# Altium project NANORACK_LASER.PrjPcb
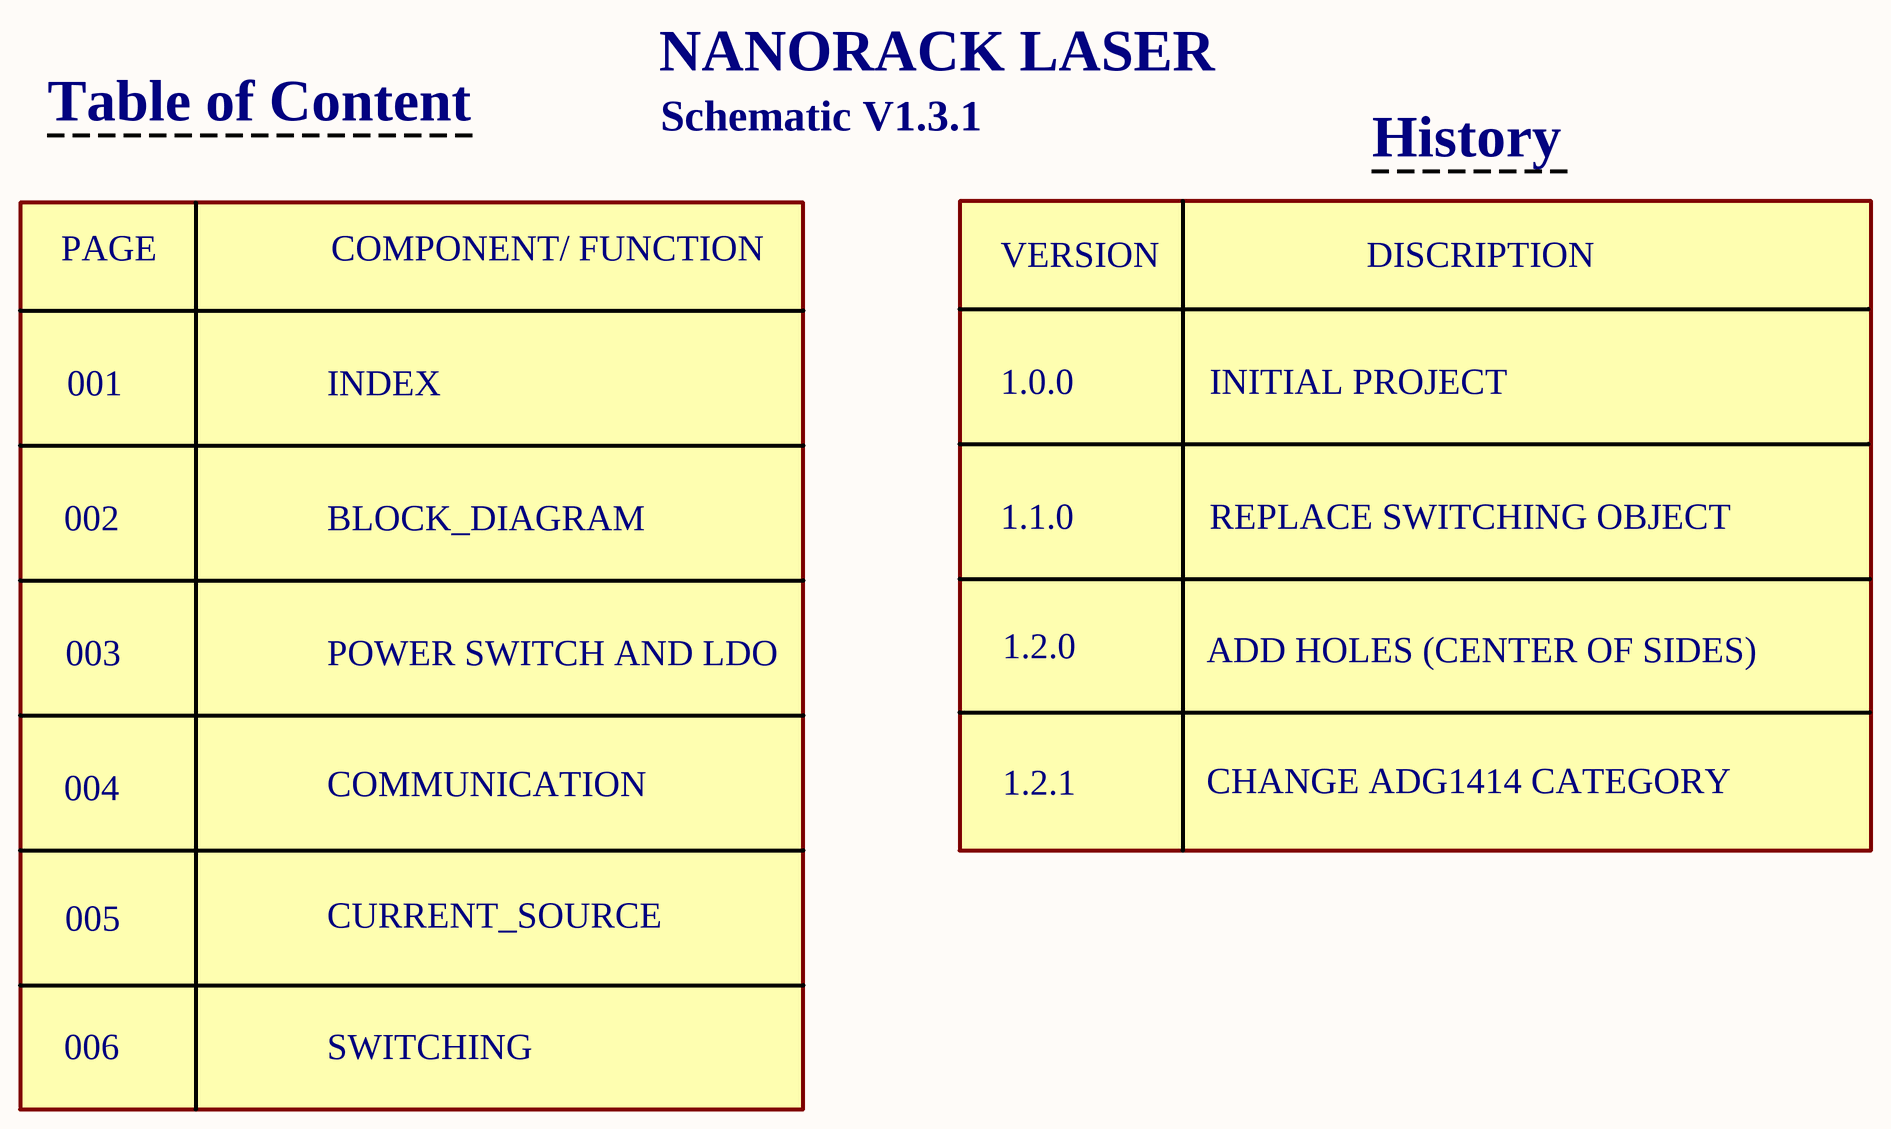
[diagram p0: INDEX.SchDoc]
4 sheets, 57 parts. Net scope: global (net labels, ports and power ports of the same name join across sheets).
Board file: LASERDIODE_V1.2.1.PcbDoc
Sheets:
  INDEX.SchDoc
  BLOCK_DIAGRAM.SchDoc
  POWER SWITCH AND LDO.SchDoc
  COMMUNICATION.SchDoc

## Sheet INDEX.SchDoc
size 420 x 297 mm; SheetNumber: 1; SheetTotal: 6

### Notes on the sheet
- NANORACK LASER
- Table of Content
- Schematic V1.3.1
- History
- PAGE
- COMPONENT/ FUNCTION
- VERSION
- DISCRIPTION
- 001
- INDEX
- 1.0.0
- INITIAL PROJECT
- 002
- BLOCK_DIAGRAM
- 1.1.0
- REPLACE SWITCHING OBJECT
- 003
- POWER SWITCH AND LDO
- 1.2.0
- ADD HOLES (CENTER OF SIDES)
- 004
- COMMUNICATION
- 1.2.1
- CHANGE ADG1414 CATEGORY
- 005
- CURRENT_SOURCE
- 006
- SWITCHING
- Project:
- BEE-PC1
- Sub-system:
- Design by:
- Hung Nguyen D.
- Bao Bui Q.
- Sheet title:
- Sheet
- A3
- of
- Checked by:
- Approved by:
- Vu Pham
- Revision:
- Document No:
- V1.2.1
- Size:
- Date:

## Sheet BLOCK_DIAGRAM.SchDoc
size 420 x 297 mm; SheetNumber: 2; SheetTotal: 6

### Notes on the sheet
- Project:
- BEE-PC1
- Sub-system:
- Design by:
- Hung Nguyen D.
- Bao Bui Q.
- Sheet title:
- Sheet
- A3
- of
- Checked by:
- Approved by:
- Vu Pham
- Revision:
- Document No:
- V1.2.1
- Size:
- Date:
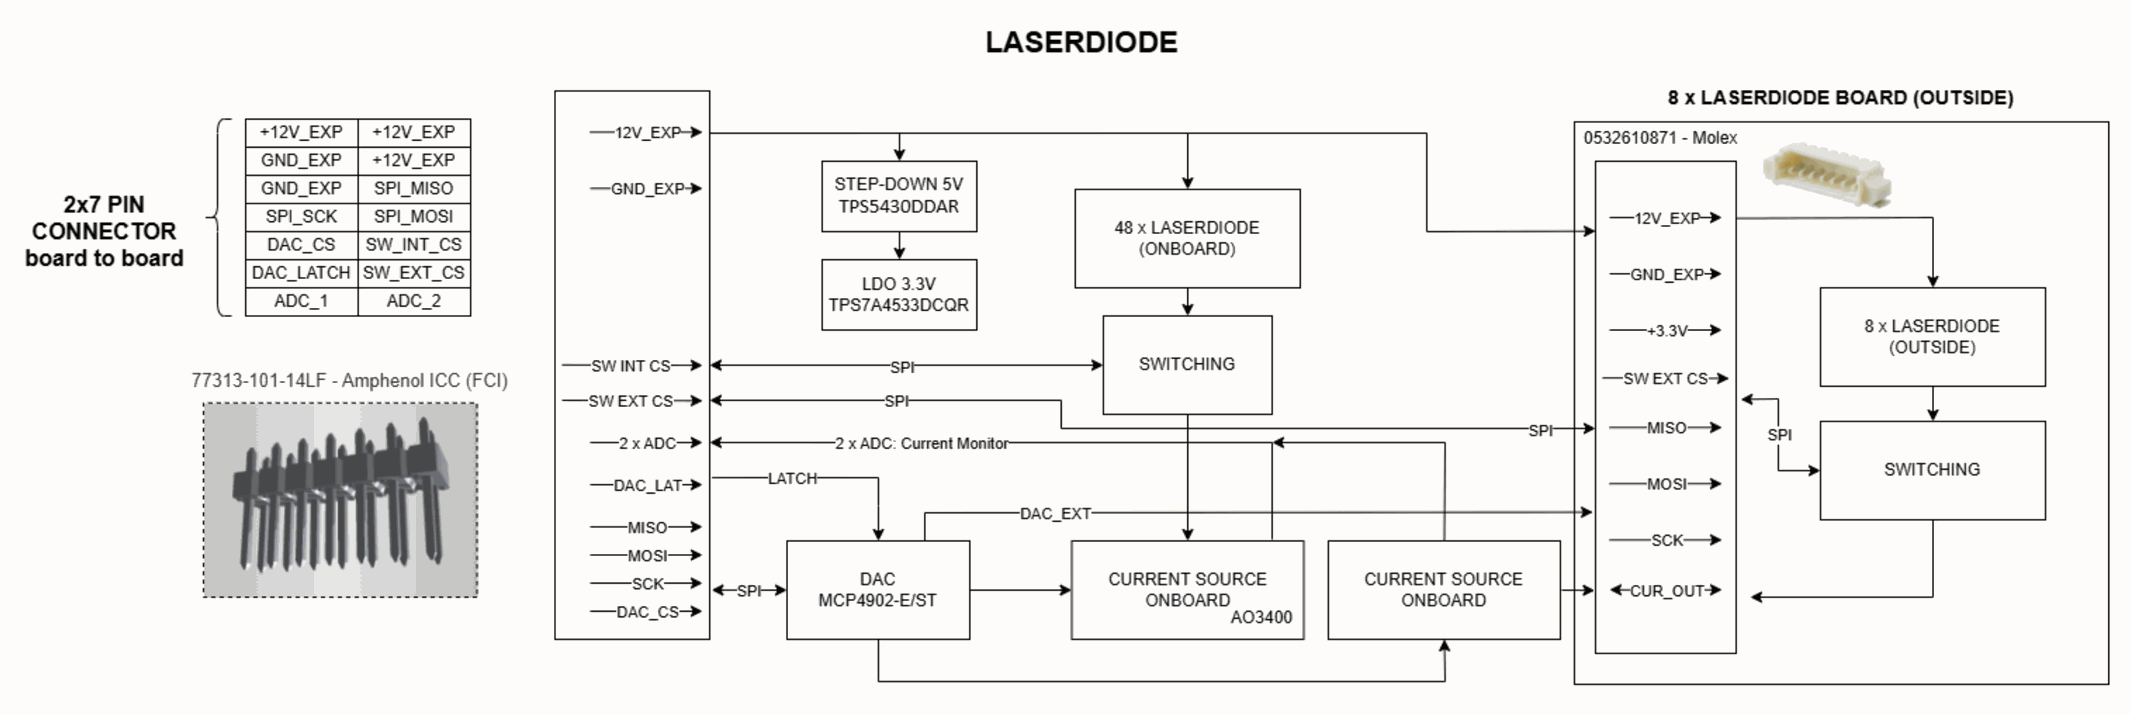
[diagram p1: BLOCK_DIAGRAM.SchDoc]

## Sheet POWER SWITCH AND LDO.SchDoc
size 420 x 297 mm; SheetNumber: 3; SheetTotal: 6
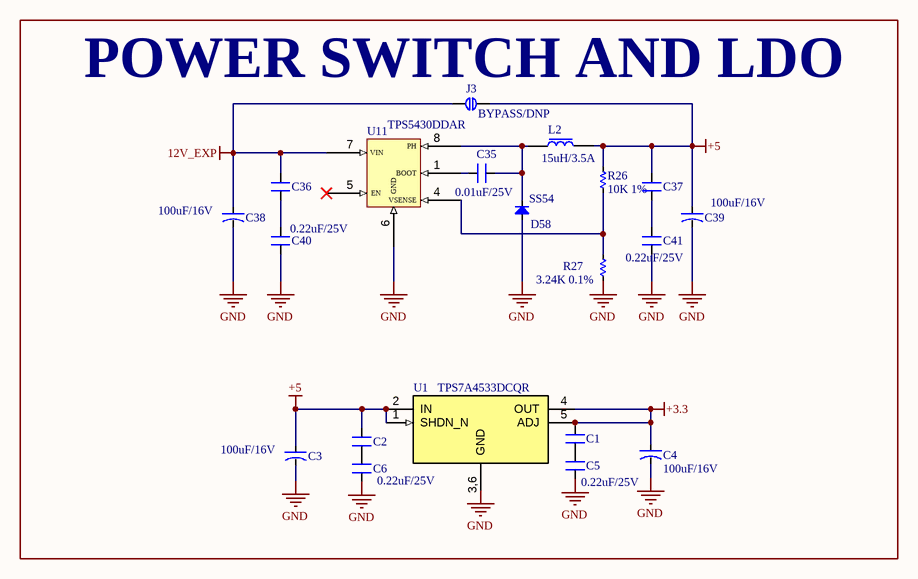
[diagram p2: POWER SWITCH AND LDO.SchDoc]

### Parts
C1  0.22uF/25V  [SM-0603]  (value not drawn)
C2  0.22uF/25V  [SM-0603]
C3  100uF/16V  [CAP TANT 2312]
C4  100uF/16V  [CAP TANT 2312]
C5  0.22uF/25V  [SM-0603]
C6  0.22uF/25V  [SM-0603]  (value not drawn)
C35  0.01uF/25V  [SM-0603]
C36  0.22uF/25V  [SM-0603]  (value not drawn)
C37  0.22uF/25V  [SM-0603]  (value not drawn)
C38  100uF/16V  [CAP TANT 2312]
C39  100uF/16V  [CAP TANT 2312]
C40  0.22uF/25V  [SM-0603]
C41  0.22uF/25V  [SM-0603]
D58  SS54  [DIO-SMD-A]
J3  BYPASS/DNP  [BIG_CONNECTOR]
L2  15uH/3.5A  [SRP7050TA]
R26  10K 1%  [RES-SMD-0603]
R27  3.24K 0.1%  [RES-SMD-0603]
U1  TPS7A4533DCQR  [SOT223-6]
U11  TPS5430DDAR  [HSOP8]

### Blocks framed on the sheet
POWER SWITCH AND LDO: C1-C6 C35-C41 D58 J3 L2 R26 R27 U1 U11

### Nets
12V_EXP: C36.2 C38.1 J3.1 U11.7(VIN)
+3.3: C1.2 C4.1 U1.4(OUT) U1.5(ADJ)
+5: C2.2 C3.1 C37.2 C39.1 J3.2 L2.2 R26.2 U1.1(SHDN_N) U1.2(IN)
GND: C3.2 C4.2 C5.1 C6.1 C38.2 C39.2 C40.1 C41.1 D58.1(A) R27.1 U1.3,6(GND) U11.6(GND)
NetC1_1: C1.1 C5.2
NetC2_1: C2.1 C6.2
NetC35_1: C35.1 D58.2(K) L2.1 U11.8(PH)
NetC35_2: C35.2 U11.1(BOOT)
NetC36_1: C36.1 C40.2
NetC37_1: C37.1 C41.2
NetR26_1: R26.1 R27.2 U11.4(VSENSE)

Not connected (* = marked no-connect by the designer): U11 5(EN)*

### Notes on the sheet
- Project:
- BEE-PC1
- Sub-system:
- Design by:
- Hung Nguyen D.
- Bao Bui Q.
- Sheet title:
- Sheet
- A3
- of
- Checked by:
- Approved by:
- Vu Pham
- Revision:
- Document No:
- V1.2.1
- Size:
- Date:

### Library data of the parts
C1 C2 C5 C6 C35-C37 C40 C41 = CM: 0603; Value: 103
C3 C4 C38 C39 = CN-ALU-SMD: Polarized Capacitor (Axial); Published: 8-Jun-2000; LatestRevisionDate: 17-Jul-2002; LatestRevisionNote: Re-released for DXP Platform.; PackageReference: POLAR0.8; Publisher: Altium Limited
D58 = Diode SMD: DIODE SCHOTTKY 40V 5A SMA; Code - JEDEC: DO-214-AB; Value: 1N5007; Published: 8-Jun-2000; Revision: July-2002: Re-released for DXP Platform.; Publisher: Altium Limited
J3 = CNT: DNP
L2 = INDUCTOR: SRP7050TA-150M
R26 = Res-SMD: 0603; Manufacturer: Generic Components; Class: Passive; Published: 08/06/2000; Publisher: Altium Hobart Technology Centre
R27 = Res-SMD: ERA-3AEB3241V; Manufacturer: Generic Components; Class: Passive; Published: 08/06/2000; Publisher: Altium Hobart Technology Centre
U1 = TPS7A4533DCQR: IC REG LINEAR 3.3V 1.5A SOT223-6
U11 = TPS543X: 8SOP; pin to pad: 6>6+9

## Sheet COMMUNICATION.SchDoc
size 420 x 297 mm; SheetNumber: 4; SheetTotal: 6
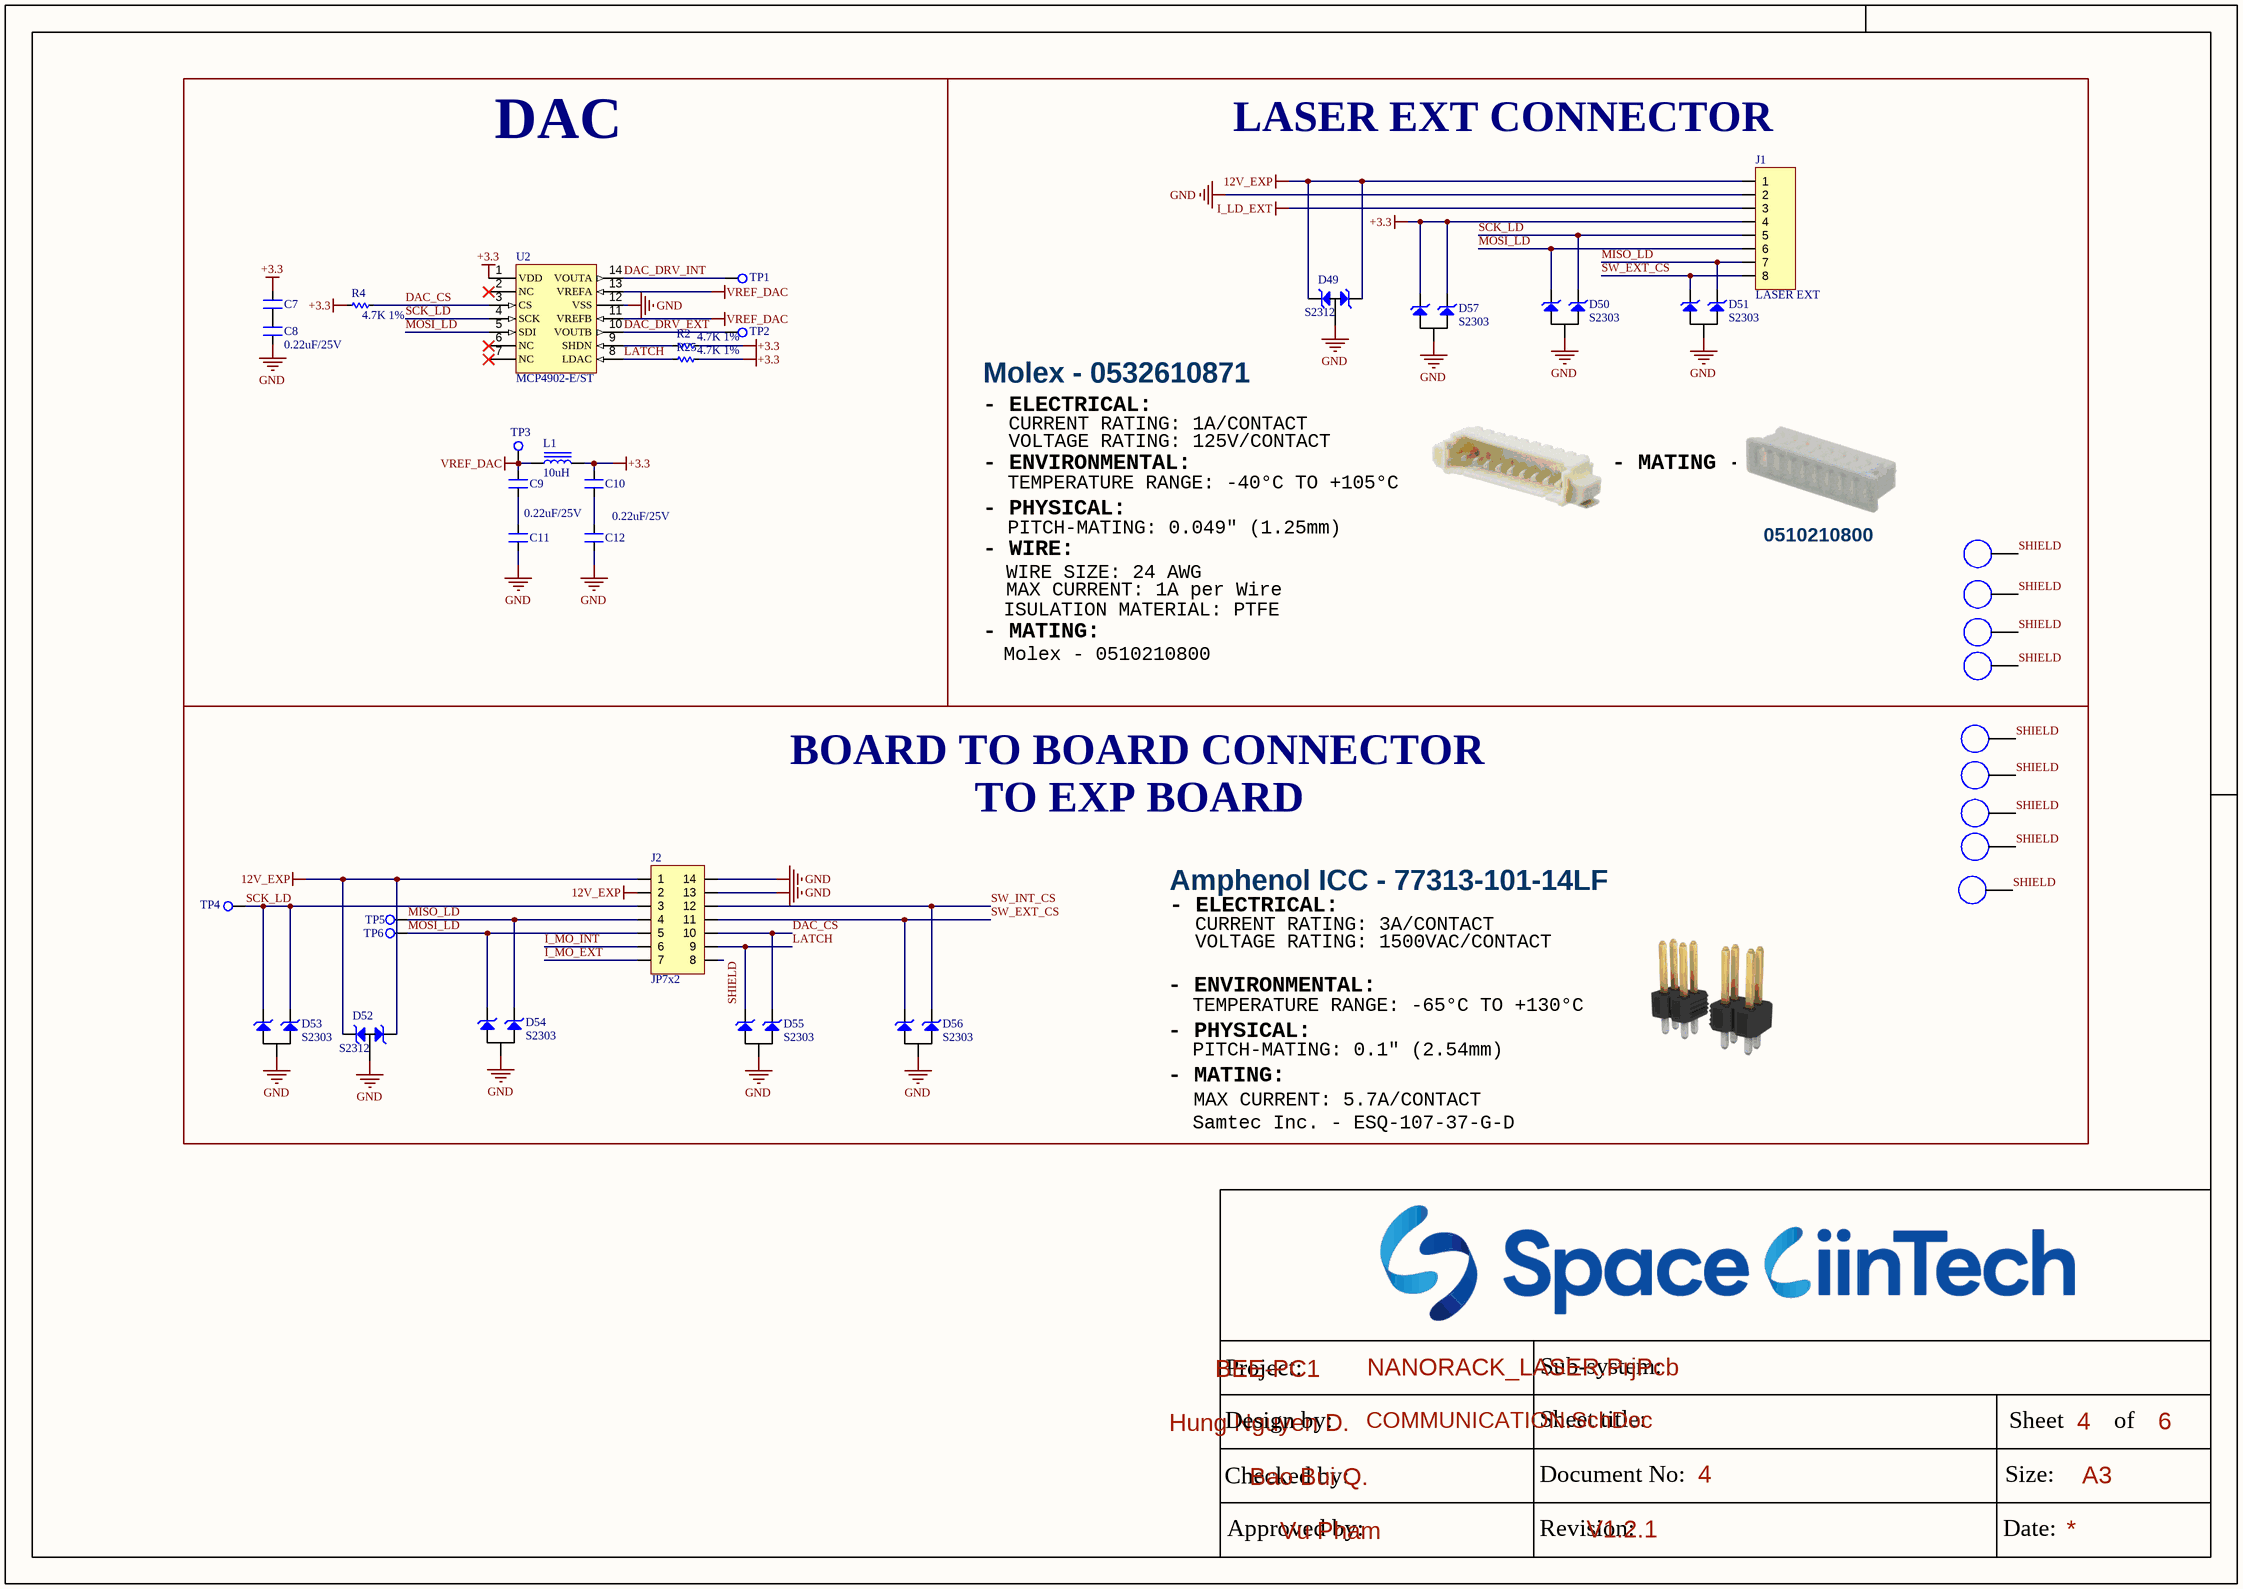
[diagram p3: COMMUNICATION.SchDoc]

### Parts
C7  0.22uF/25V  [SM-0603]  (value not drawn)
C8  0.22uF/25V  [SM-0603]
C9  0.22uF/25V  [SM-0603]  (value not drawn)
C10  0.22uF/25V  [SM-0603]  (value not drawn)
C11  0.22uF/25V  [SM-0603]
C12  0.22uF/25V  [SM-0603]
D49  S2312  [SOT23-123]
D50  S2303  [SOT23-123]
D51  S2303  [SOT23-123]
D52  S2312  [SOT23-123]
D53  S2303  [SOT23-123]
D54  S2303  [SOT23-123]
D55  S2303  [SOT23-123]
D56  S2303  [SOT23-123]
D57  S2303  [SOT23-123]
H1  HOLD  [M3]  (value not drawn)
H2  HOLD  [M3]  (value not drawn)
H3  HOLD  [M3]  (value not drawn)
H4  HOLD  [M3]  (value not drawn)
H5  HOLD  [M3]  (value not drawn)
H6  HOLD  [M3]  (value not drawn)
H7  HOLD  [M3]  (value not drawn)
H8  HOLD  [M3]  (value not drawn)
H9  HOLD  [M3]  (value not drawn)
J1  LASER EXT  [0532610871]
J2  JP7x2  [JP7-D2T]
L1  10uH  [FER 0805/2012]
R2  4.7K 1%  [RES-SMD-0603]
R4  4.7K 1%  [RES-SMD-0603]
R25  4.7K 1%  [RES-SMD-0603]
TP1  Test_Point  [TESTPOINT]  (value not drawn)
TP2  Test_Point  [TESTPOINT]  (value not drawn)
TP3  Test_Point  [TESTPOINT]  (value not drawn)
TP4  Test_Point  [TESTPOINT]  (value not drawn)
TP5  Test_Point  [TESTPOINT]  (value not drawn)
TP6  Test_Point  [TESTPOINT]  (value not drawn)
U2  MCP4902-E/ST  [TSSOP14]

### Blocks framed on the sheet
DAC: C7-C12 L1 R2 R4 R25 TP1-TP3 U2
LASER EXT CONNECTOR: D49-D51 D57 H1-H3 H8 J1

### Nets
12V_EXP: D49.1 D49.3 D52.1 D52.3 J1.1 J2.1 J2.2
+3.3: C7.2 C10.2 D57.1 D57.3 J1.4 L1.2 R2.1 R4.2 R25.1 U2.1(VDD)
GND: C8.1 C11.1 C12.1 D49.2 D50.2 D51.2 D52.2 D53.2 D54.2 D55.2 D56.2 D57.2 J1.2 J2.13 J2.14 U2.12(VSS)
I_LD_EXT: J1.3
VREF_DAC: C9.2 L1.1 TP3.1 U2.11(VREFB) U2.13(VREFA)
DAC_CS: D55.3 J2.10 R4.1 U2.3(CS)
DAC_DRV_EXT: TP2.1 U2.10(VOUTB)
DAC_DRV_INT: TP1.1 U2.14(VOUTA)
I_MO_EXT: J2.7
I_MO_INT: J2.6
LATCH: D55.1 J2.9 R25.2 U2.8(LDAC)
MISO_LD: D51.3 D54.3 J1.7 J2.4 TP5.1
MOSI_LD: D50.1 D54.1 J1.6 J2.5 TP6.1 U2.5(SDI)
SCK_LD: D50.3 D53.1 D53.3 J1.5 J2.3 TP4.1 U2.4(SCK)
SHIELD: H1.1 H2.1 H3.1 H4.1 H5.1 H6.1 H7.1 H8.1 H9.1 J2.8
SW_EXT_CS: D51.1 D56.1 J1.8 J2.11
SW_INT_CS: D56.3 J2.12
NetC7_1: C7.1 C8.2
NetC9_1: C9.1 C11.2
NetC10_1: C10.1 C12.2
NetR2_2: R2.2 U2.9(SHDN)

Not connected (* = marked no-connect by the designer): U2 2(NC)* 6(NC)* 7(NC)*

### Notes on the sheet
- Molex - 0532610871
- - ELECTRICAL:
- CURRENT RATING: 1A/CONTACT
- VOLTAGE RATING: 125V/CONTACT
- - ENVIRONMENTAL:
- - PHYSICAL:
- TEMPERATURE RANGE: -40°C TO +105°C
- - MATING -
- - WIRE:
- WIRE SIZE: 24 AWG
- MAX CURRENT: 1A per Wire
- PITCH-MATING: 0.049" (1.25mm)
- 0510210800
- - MATING:
- ISULATION MATERIAL: PTFE
- Molex - 0510210800
- BOARD TO BOARD CONNECTOR
- TO EXP BOARD
- Amphenol ICC - 77313-101-14LF
- CURRENT RATING: 3A/CONTACT
- VOLTAGE RATING: 1500VAC/CONTACT
- TEMPERATURE RANGE: -65°C TO +130°C
- PITCH-MATING: 0.1" (2.54mm)
- Samtec Inc. - ESQ-107-37-G-D
- MAX CURRENT: 5.7A/CONTACT
- Project:
- BEE-PC1
- Sub-system:
- Design by:
- Hung Nguyen D.
- Bao Bui Q.
- Sheet title:
- Sheet
- A3
- of
- Checked by:
- Approved by:
- Vu Pham
- Revision:
- Document No:
- V1.2.1
- Size:
- Date:

### Library data of the parts
C7-C12 = CM: 0603; Value: 103
D49 D52 = S2315: TVS DIODE 12VWM 19VC SOT23, P/N:  S2312
D50 D51 D53-D57 = S2303: TVS DIODE 3.3VWM 8VC SOT23, P/N: / S2303
H1-H9 = PAD_HOLD
J1 = JP8: WR-PHD 2.54 mm Angled Socket Header; Manufacturer: W¨¹rth Elektronik eiSos GmbH; partNo: 613008143121; ComponentLink1 Description: Manufacturer; ComponentLink2 Description: Datasheet; NoPins: 08; Created Date: 29 March 2013; ComponentLink1URL: http://www.we-online.com; ComponentLink2URL: http://katalog.we-online.de/em/datasheet/6130xx143121.pdf; Created by: Karrer Zheng
J2 = JP7x2: WR-PHD 2.54 mm Dual Socket Header; Manufacturer: W¨¹rth Elektronik eiSos GmbH; partNo: 61301421821; ComponentLink1 Description: Manufacturer; ComponentLink2 Description: Datasheet; NoPins: 14; Created Date: 29 March 2013; ComponentLink1URL: http://www.we-online.com; ComponentLink2URL: http://katalog.we-online.de/em/datasheet/6130xx21821.pdf; Created by: Karrer Zheng
L1 = Inductor: MLZ1608N100LT000; Value: 1.5uH
R2 R4 R25 = Res-SMD: as R26 on sheet POWER SWITCH AND LDO; Published: 08/06/2000; Publisher: Altium Hobart Technology Centre
U2 = MCP4902: IC DAC 8BIT V-OUT 14TSSOP

## Nets that join several sheets
12V_EXP: POWER SWITCH AND LDO (C36.2 C38.1 J3.1 U11.7), COMMUNICATION (7 pins)
+3.3: POWER SWITCH AND LDO (C1.2 C4.1 U1.4 U1.5), COMMUNICATION (10 pins)
GND: POWER SWITCH AND LDO (12 pins), COMMUNICATION (16 pins)